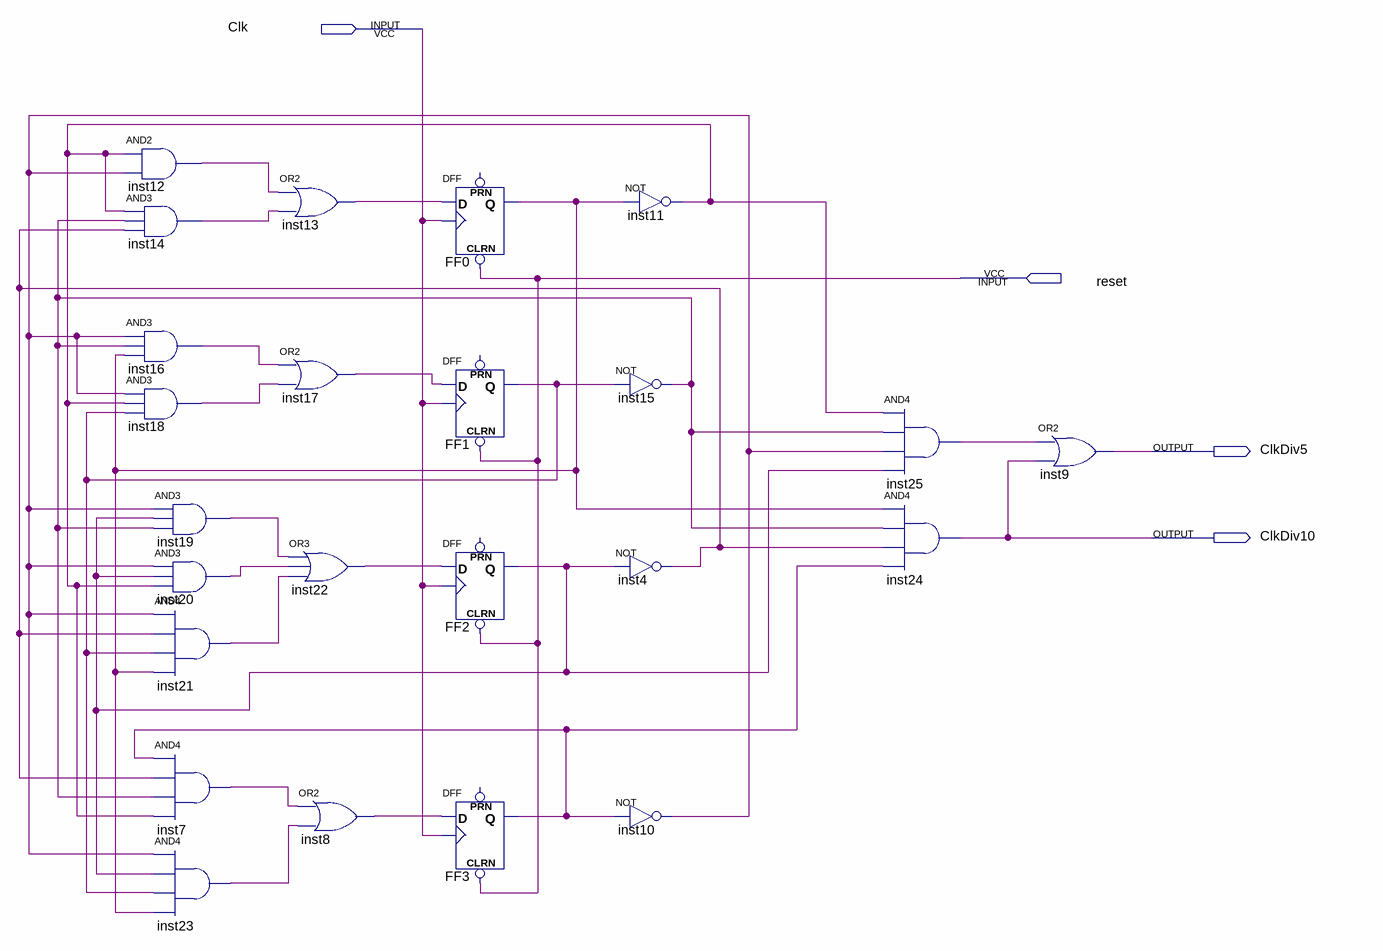
[diagram p0: schematic sheet]
// Quartus schematic DivisorDeClock.bdf as structural Verilog: 24 symbols, 4 pins
module DivisorDeClock (
  input  Clk,
  input  reset,
  output ClkDiv5,
  output ClkDiv10
);

  wire FF0_q, FF1_q, FF2_q, FF3_q, inst4_out, inst7_out, inst8_out, inst10_out, inst11_out, inst12_out,
       inst13_out, inst14_out, inst15_out, inst16_out, inst17_out, inst18_out, inst19_out, inst20_out,
       inst21_out, inst22_out, inst23_out, inst25_out;

  and inst12 (inst12_out, inst11_out, inst10_out);
  and inst14 (inst14_out, inst11_out, inst15_out, inst4_out);
  and inst16 (inst16_out, inst10_out, inst15_out, FF0_q);
  and inst18 (inst18_out, inst10_out, inst11_out, FF1_q);
  and inst19 (inst19_out, inst10_out, FF2_q, inst15_out);
  and inst20 (inst20_out, inst10_out, FF2_q, inst11_out);
  and inst21 (inst21_out, inst10_out, inst4_out, FF1_q, FF0_q);
  and inst7 (inst7_out, FF3_q, inst4_out, inst15_out, inst11_out);
  and inst23 (inst23_out, inst10_out, FF2_q, FF1_q, FF0_q);
  or inst13 (inst13_out, inst12_out, inst14_out);
  or inst17 (inst17_out, inst16_out, inst18_out);
  or inst22 (inst22_out, inst19_out, inst20_out, inst21_out);
  or inst8 (inst8_out, inst7_out, inst23_out);
  DFF FF0 (.CLRN(reset), .CLK(Clk), .D(inst13_out), .Q(FF0_q));  // open: PRN
  DFF FF1 (.CLRN(reset), .CLK(Clk), .D(inst17_out), .Q(FF1_q));  // open: PRN
  DFF FF2 (.CLRN(reset), .CLK(Clk), .D(inst22_out), .Q(FF2_q));  // open: PRN
  DFF FF3 (.CLRN(reset), .CLK(Clk), .D(inst8_out), .Q(FF3_q));  // open: PRN
  not inst11 (inst11_out, FF0_q);
  not inst15 (inst15_out, FF1_q);
  not inst4 (inst4_out, FF2_q);
  not inst10 (inst10_out, FF3_q);
  and inst25 (inst25_out, inst11_out, inst15_out, inst10_out, FF2_q);
  and inst24 (ClkDiv10, FF0_q, inst15_out, inst4_out, FF3_q);
  or inst9 (ClkDiv5, inst25_out, ClkDiv10);
endmodule
